# Altium schematic sheet Power.SchDoc
size A
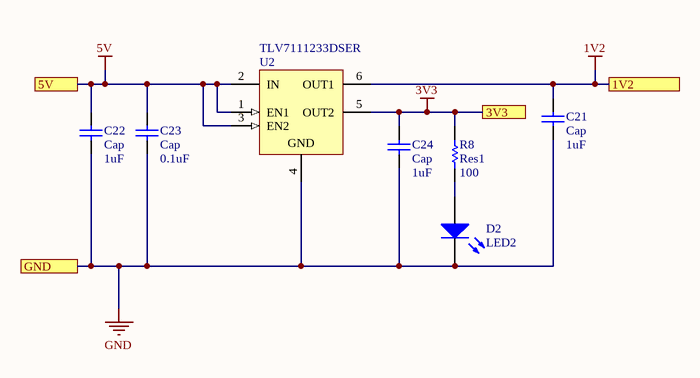
[diagram p0: Power.SchDoc]

## Parts
C21  Cap  value 1uF  [RAD-0.3]
C22  Cap  value 1uF  [RAD-0.3]
C23  Cap  value 0.1uF  [RAD-0.3]
C24  Cap  value 1uF  [RAD-0.3]
D2  LED2  [3.2X1.6X1.1]
R8  Res1  value 100  [AXIAL-0.3]
U2  TLV7111233DSER  [TI-DSE6_V]

## Ports
1V2, 3V3, 5V, GND

## Nets
1V2: C21.2 U2.6(OUT1) ; port 1V2
3V3: C24.2 R8.2 U2.5(OUT2) ; port 3V3
5V: C22.1 C23.2 U2.1(EN1) U2.2(IN) U2.3(EN2) ; port 5V
GND: C21.1 C22.2 C23.1 C24.1 D2.2(K) U2.4(GND) ; port GND
NetD2_1: D2.1(A) R8.1

## Library data of the parts
C21-C24 = Cap: Capacitor; Published: 8-Jun-2000; LatestRevisionDate: 17-Jul-2002; LatestRevisionNote: Re-released for DXP Platform.; PackageReference: RAD-0.3; Publisher: Altium Limited; PackageDescription: Radial Cap, Thru-Hole; 2 Leads; 0.3 in Pin Spacing
D2 = LED2: Typical RED, GREEN, YELLOW, AMBER GaAs LED; Published: 8-Jun-2000; LatestRevisionDate: 17-Jul-2002; LatestRevisionNote: Re-released for DXP Platform.; PackageVersion: Feb-2002; PackageReference: 3.2X1.6X1.1; Publisher: Altium Limited; PackageDescription: SM LED; 2 Flat Leads
R8 = Res1: Resistor; Published: 8-Jun-2000; LatestRevisionDate: 17-Jul-2002; LatestRevisionNote: Re-released for DXP Platform.; PackageReference: AXIAL-0.3; Publisher: Altium Limited; PackageDescription: Axial Device, Thru-Hole; 2 Leads; 0.3 in Pin Spacing
U2 = TLV7111233DSER: Dual Output High PSRR LDO, 200 mA, Fixed 1.2, 3.3 V Output, 2 to 5.5 V Input, 6-pin WSON (DSE), -40 to 125 degC, Green (RoHS & no Sb/Br); Manufacturer: Texas Instruments; Iout(Max)(A): 0.2; Iq(Typ)(mA): 0.03; SubFamily: Dual Channel LDO; Vdo(Typ)(mV): 175; Vin(Max)(V): 5.5; Vin(Min)(V): 2; DatasheetVersion: SBVS142A; PackageVersion: 4207810/A; PackageReference: DSE6; PackageDescription: 6-Pin Plastic Small Outline, Body 1.5 x 1.5 mm, Pitch 0.5 mm; Supplier 1: Digi-Key; Supplier Part Number 1: 296-28453-2-ND; Supplier 2: Digi-Key; Supplier Part Number 2: 296-28453-1-ND; Supplier 3: Digi-Key; Supplier Part Number 3: 296-28453-6-ND; Supplier 4: Mouser; Supplier Part Number 4: 595-TLV7111233DSER; Eco-Plan: Green (RoHS & no Sb/Br); Fixed Output Options(V): 1.2, 3.3; Mounting Technology: Surface Mount; PartNumber: TLV7111233DSER; ComponentLink1Description: Manufacturer URL; ComponentLink1URL: http://www.ti.com/; ComponentLink2Description: Datasheet; ComponentLink2URL: http://www.ti.com/general/docs/lit/getliterature.tsp?genericPartNumber=TLV7111233&fileType=pdf; ComponentLink3Description: Package Specification; ComponentLink3URL: http://www.ti.com/litv/pdf/mpds287